# Altium schematic sheet MIXR Input System - Buffer.SchDoc
size B
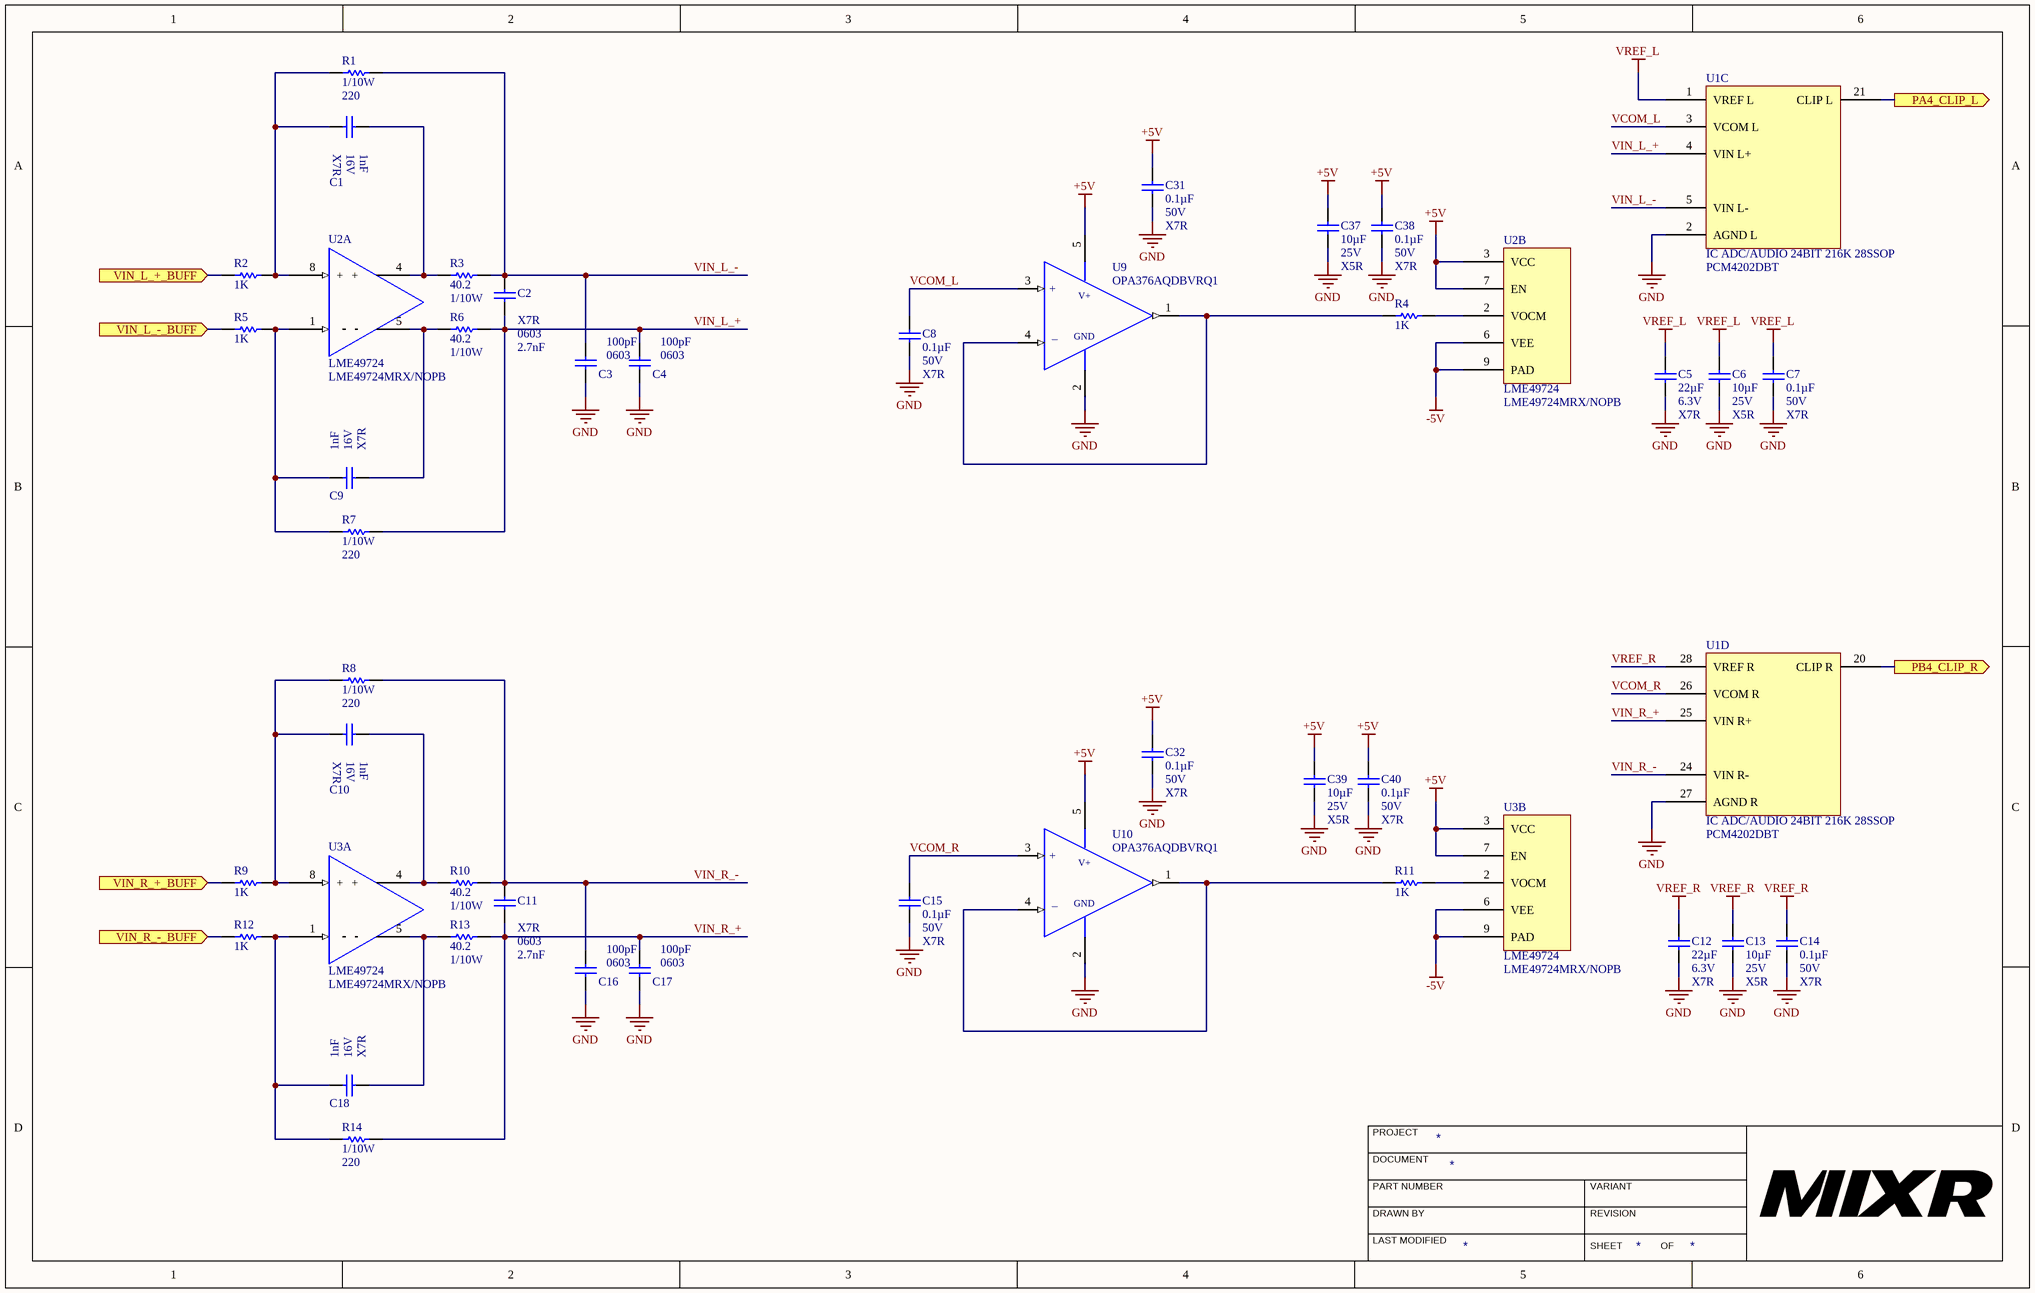
[diagram p0: MIXR Input System - Buffer.SchDoc]

## Parts
C1  CAP CER 1NF 16V 10% X7R 0603  [CAP, 0603]  (value not drawn)
C2  Dielectric: X7R  Case Code (Imperial): 0603  Capacitance: 2.7nF  [CAP, 0603]  (hidden comment: CAP CER 2700PF 50V X7R 0603)
C3  Case Code (Imperial): 0603  Capacitance: 100pF  [CAP, 0603]  (hidden comment: CAP CER 100PF 50V C0G/NP0 0603)
C4  Case Code (Imperial): 0603  Capacitance: 100pF  [CAP, 0603]  (hidden comment: CAP CER 100PF 50V C0G/NP0 0603)
C5  Capacitance: 22µF  Voltage: 6.3V  Temperature Coefficient: X7R  [CAP, 1206]  (hidden comment: CAP CER 22UF 6.3V ±10% X7R 1206)
C6  Capacitance: 10µF  Voltage: 25V  Temperature Coefficient: X5R  [CAP, 0603]  (hidden comment: CAP CER 10uF 25V 20% X5R 0603)
C7  Capacitance: 0.1µF  Voltage: 50V  Temperature Coefficient: X7R  [CAP, 0603]  (hidden comment: CAP CER 0.1UF 50V 10% X7R 0603)
C8  Capacitance: 0.1µF  Voltage: 50V  Temperature Coefficient: X7R  [CAP, 0603]  (hidden comment: CAP CER 0.1UF 50V 10% X7R 0603)
C9  CAP CER 1NF 16V 10% X7R 0603  [CAP, 0603]  (value not drawn)
C10  CAP CER 1NF 16V 10% X7R 0603  [CAP, 0603]  (value not drawn)
C11  Dielectric: X7R  Case Code (Imperial): 0603  Capacitance: 2.7nF  [CAP, 0603]  (hidden comment: CAP CER 2700PF 50V X7R 0603)
C12  Capacitance: 22µF  Voltage: 6.3V  Temperature Coefficient: X7R  [CAP, 1206]  (hidden comment: CAP CER 22UF 6.3V ±10% X7R 1206)
C13  Capacitance: 10µF  Voltage: 25V  Temperature Coefficient: X5R  [CAP, 0603]  (hidden comment: CAP CER 10uF 25V 20% X5R 0603)
C14  Capacitance: 0.1µF  Voltage: 50V  Temperature Coefficient: X7R  [CAP, 0603]  (hidden comment: CAP CER 0.1UF 50V 10% X7R 0603)
C15  Capacitance: 0.1µF  Voltage: 50V  Temperature Coefficient: X7R  [CAP, 0603]  (hidden comment: CAP CER 0.1UF 50V 10% X7R 0603)
C16  Case Code (Imperial): 0603  Capacitance: 100pF  [CAP, 0603]  (hidden comment: CAP CER 100PF 50V C0G/NP0 0603)
C17  Case Code (Imperial): 0603  Capacitance: 100pF  [CAP, 0603]  (hidden comment: CAP CER 100PF 50V C0G/NP0 0603)
C18  CAP CER 1NF 16V 10% X7R 0603  [CAP, 0603]  (value not drawn)
C31  Capacitance: 0.1µF  Voltage: 50V  Temperature Coefficient: X7R  [CAP, 0603]  (hidden comment: CAP CER 0.1UF 50V 10% X7R 0603)
C32  Capacitance: 0.1µF  Voltage: 50V  Temperature Coefficient: X7R  [CAP, 0603]  (hidden comment: CAP CER 0.1UF 50V 10% X7R 0603)
C37  Capacitance: 10µF  Voltage: 25V  Temperature Coefficient: X5R  [CAP, 0603]  (hidden comment: CAP CER 10uF 25V 20% X5R 0603)
C38  Capacitance: 0.1µF  Voltage: 50V  Temperature Coefficient: X7R  [CAP, 0603]  (hidden comment: CAP CER 0.1UF 50V 10% X7R 0603)
C39  Capacitance: 10µF  Voltage: 25V  Temperature Coefficient: X5R  [CAP, 0603]  (hidden comment: CAP CER 10uF 25V 20% X5R 0603)
C40  Capacitance: 0.1µF  Voltage: 50V  Temperature Coefficient: X7R  [CAP, 0603]  (hidden comment: CAP CER 0.1UF 50V 10% X7R 0603)
R1  Power (Watts): 1/10W  Resistance: 220  [RES, 0603]  (hidden comment: RES 220 OHM 1% 1/10W 0603)
R2  1K  [RES, 0603]
R3  Resistance: 40.2  Power: 1/10W  [RES, 0603]  (hidden comment: RES 40.2 OHM 0.5% 1/10W 0603)
R4  1K  [RES, 0603]
R5  1K  [RES, 0603]
R6  Resistance: 40.2  Power: 1/10W  [RES, 0603]  (hidden comment: RES 40.2 OHM 0.5% 1/10W 0603)
R7  Power (Watts): 1/10W  Resistance: 220  [RES, 0603]  (hidden comment: RES 220 OHM 1% 1/10W 0603)
R8  Power (Watts): 1/10W  Resistance: 220  [RES, 0603]  (hidden comment: RES 220 OHM 1% 1/10W 0603)
R9  1K  [RES, 0603]
R10  Resistance: 40.2  Power: 1/10W  [RES, 0603]  (hidden comment: RES 40.2 OHM 0.5% 1/10W 0603)
R11  1K  [RES, 0603]
R12  1K  [RES, 0603]
R13  Resistance: 40.2  Power: 1/10W  [RES, 0603]  (hidden comment: RES 40.2 OHM 0.5% 1/10W 0603)
R14  Power (Watts): 1/10W  Resistance: 220  [RES, 0603]  (hidden comment: RES 220 OHM 1% 1/10W 0603)
U1  IC ADC/AUDIO 24BIT 216K 28SSOP  Manufacturer Part Number: PCM4202DBT  [IC ADC 24 BIT AUDIO 216 KHZ SSOP-28]  (parts C,D of 4)
U2  LME49724  Manufacturer Part Number: LME49724MRX/NOPB  [IC OP AMP AUDIO LME49724 8-SOIC]  (parts A,B of 2)
U3  LME49724  Manufacturer Part Number: LME49724MRX/NOPB  [IC OP AMP AUDIO LME49724 8-SOIC]  (parts A,B of 2)
U9  Manufacturer Part Number: OPA376AQDBVRQ1  [IC OP AMP GP RR 10MHZ SOT-23-5]  (hidden comment: IC OP AMP GEN PURPOSE RR 5.5MHZ SOT-23-5)
U10  Manufacturer Part Number: OPA376AQDBVRQ1  [IC OP AMP GP RR 10MHZ SOT-23-5]  (hidden comment: IC OP AMP GEN PURPOSE RR 5.5MHZ SOT-23-5)

## Ports
PA4_CLIP_L (out), PB4_CLIP_R (out), VIN_L_+_BUFF (in), VIN_L_-_BUFF (in), VIN_R_+_BUFF (in), VIN_R_-_BUFF (in)

## Nets
+5V: C31.1 C32.1 C37.1 C38.1 C39.1 C40.1 U2.3(VCC) U2.7(EN) U3.3(VCC) U3.7(EN) U9.5(VDD) U10.5(VDD)
-5V: U2.6(VEE) U2.9(PAD) U3.6(VEE) U3.9(PAD)
GND: C3.2 C4.2 C5.2 C6.2 C7.2 C8.2 C12.2 C13.2 C14.2 C15.2 C16.2 C17.2 C31.2 C32.2 C37.2 C38.2 C39.2 C40.2 U1.2(AGND_L) U1.27(AGND_R) U9.2(VSS) U10.2(VSS)
VREF_L: C5.1 C6.1 C7.1 U1.1(VREF_L)
VREF_R: C12.1 C13.1 C14.1 U1.28(VREF_R)
PA4_CLIP_L: U1.21(CLIP_L) ; port PA4_CLIP_L
PB4_CLIP_R: U1.20(CLIP_R) ; port PB4_CLIP_R
VCOM_L: C8.1 U1.3(VCOM_L) U9.3(+IN)
VCOM_R: C15.1 U1.26(VCOM_R) U10.3(+IN)
VIN_L_+: C2.2 C4.1 R6.2 R7.1 U1.4(VIN_L+)
VIN_L_+_BUFF: R2.1 ; port VIN_L_+_BUFF
VIN_L_-: C2.1 C3.1 R1.2 R3.2 U1.5(VIN_L-)
VIN_L_-_BUFF: R5.1 ; port VIN_L_-_BUFF
VIN_R_+: C11.2 C17.1 R13.2 R14.1 U1.25(VIN_R+)
VIN_R_+_BUFF: R9.1 ; port VIN_R_+_BUFF
VIN_R_-: C11.1 C16.1 R8.2 R10.2 U1.24(VIN_R-)
VIN_R_-_BUFF: R12.1 ; port VIN_R_-_BUFF
NetC1_1: C1.1 R3.1 U2.4(+)
NetC1_2: C1.2 R1.1 R2.2 U2.8(+)
NetC9_1: C9.1 R5.2 R7.2 U2.1(-)
NetC9_2: C9.2 R6.1 U2.5(-)
NetC10_1: C10.1 R10.1 U3.4(+)
NetC10_2: C10.2 R8.1 R9.2 U3.8(+)
NetC18_1: C18.1 R12.2 R14.2 U3.1(-)
NetC18_2: C18.2 R13.1 U3.5(-)
NetR4_1: R4.1 U9.1(OUTPUT) U9.4(-IN)
NetR4_2: R4.2 U2.2(VOCM)
NetR11_1: R11.1 U10.1(OUTPUT) U10.4(-IN)
NetR11_2: R11.2 U3.2(VOCM)

## Notes on the sheet
- PROJECT
- DOCUMENT
- DRAWN BY
- LAST MODIFIED
- PART NUMBER
- REVISION
- SHEET
- VARIANT
- OF
- (in symbol CAP CER 1NF 16V 10% X7R 0603) X7R; 16V; 1nF
- (in symbol IC OP AMP GEN PURPOSE RR 5.5MHZ SOT-23-5) +; V+; GND; _

## Library data of the parts
C1 C9 C10 C18 = CAP CER 1NF 16V 10% X7R 0603: 1000pF ±10% 16V Ceramic Capacitor X7R 0603 (1608 Metric); Manufacturer: KEMET; Manufacturer Part Number: C0603C102K4RECAUTO; Supplier 1: Digi-Key; RoHS: No; Stock 1: 7692; Pricing 1: 1 = 0.19000, 10 = 0.13200, 100 = 0.06210, 500 = 0.04356, 1000 = 0.03606 (USD); ComponentLink1URL: https://api.kemet.com/component-edge/download/datasheet/C0603C102K4RECAUTO.pdf?src-supplier=Digi-Key; ComponentLink1Description: https://api.kemet.com/component-edge/download/datasheet/C0603C102K4RECAUTO.pdf?src-supplier=Digi-Key; Supplier Part Number 1: 399-17878-1-ND
C2 C11 = CAP CER 2700PF 50V X7R 0603: 2700pF ±10% 50V Ceramic Capacitor X7R 0603 (1608 Metric); Manufacturer: KEMET; Manufacturer Part Number: C0603C272K5RACTU; Supplier 1: Digi-Key; RoHS: Yes; Stock 1: 166011; Pricing 1: 1 = 0.11000, 10 = 0.08200, 100 = 0.03660, 500 = 0.02614, 1000 = 0.02054 (USD); Mount: Surface Mount; Case/Package: 0603; Number of Pins: 2; Case Code (Metric): 1608; Dielectric Material: Ceramic; Min Operating Temperature: -55°C; Max Operating Temperature: 125°C; Voltage Rating: 50V; Tolerance: 10%; Packaging: Tape and Reel; Voltage Rating (DC): 50V; Package Quantity: 1; Termination: SMD/SMT; Voltage: 50V; Length: 1.6mm; Height: 0.8mm; Width: 0.031inch; Thickness: 0.034inch; Lead Pitch: 0.7mm; Depth: 0.8mm; Radiation Hardening: No; REACH SVHC: No SVHC; ComponentLink1URL: https://datasheet.ciiva.com/18192/getdatasheetpartid-321287-18192955.pdf?src-supplier=Verical; ComponentLink1Description: https://datasheet.ciiva.com/18192/getdatasheetpartid-321287-18192955.pdf?src-supplier=Verical; ComponentLink2URL: https://datasheet.ciiva.com/7823/1633156-7823726.pdf?src-supplier=Element14; ComponentLink2Description: https://datasheet.ciiva.com/7823/1633156-7823726.pdf?src-supplier=Element14; ComponentLink3URL: https://datasheet.ciiva.com/7823/1633156-7823727.pdf?src-supplier=Element14; ComponentLink3Description: https://datasheet.ciiva.com/7823/1633156-7823727.pdf?src-supplier=Element14; Supplier Part Number 1: 399-7890-1-ND
C3 C4 C16 C17 = CAP CER 100PF 50V C0G/NP0 0603: 100pF ±1% 50V Ceramic Capacitor C0G, NP0 0603 (1608 Metric); Manufacturer: Kyocera AVX; Manufacturer Part Number: 06035A101FAT2A; Supplier 1: Digi-Key; Stock 1: 176069; Pricing 1: 1=0.24, 10=0.161, 100=0.0814, 500=0.0557, 1000=0.0493 (USD); Mount: Surface Mount; Case/Package: 0603; Case Code (Metric): 1608; Min Operating Temperature: -55°C; Max Operating Temperature: 125°C; Tolerance: 1%; Packaging: Tape and Reel; Voltage Rating: 50V; Package Quantity: 1; Voltage Rating (DC): 50V; Dielectric: C0G; Termination: SMD/SMT; Voltage: 50V; Length: 1.6mm; Height: 0.86mm; Width: 0.81mm; Thickness: 0.035inch; Depth: 0.81mm; Radiation Hardening: No; REACH SVHC: No SVHC; Lead Free: Lead Free; ComponentLink1URL: https://datasheet.ciiva.com/22682/1796416-22682854.pdf; ComponentLink1Description: https://datasheet.ciiva.com/22682/1796416-22682854.pdf; ComponentLink2URL: https://datasheet.ciiva.com/150/ccog-150746.pdf; ComponentLink2Description: https://datasheet.ciiva.com/150/ccog-150746.pdf; ComponentLink3URL: https://datasheet.ciiva.com/150/ccog-150747.pdf; ComponentLink3Description: https://datasheet.ciiva.com/150/ccog-150747.pdf; ComponentLink4URL: https://datasheet.ciiva.com/150/ccog-150748.pdf; ComponentLink4Description: https://datasheet.ciiva.com/150/ccog-150748.pdf; ComponentLink5URL: https://datasheet.ciiva.com/28585/1796416-28585980.pdf; ComponentLink5Description: https://datasheet.ciiva.com/28585/1796416-28585980.pdf; ComponentLink6URL: https://datasheet.ciiva.com/16300/ccog-16300413.pdf; ComponentLink6Description: https://datasheet.ciiva.com/16300/ccog-16300413.pdf; ComponentLink7URL: https://datasheet.ciiva.com/17492/ccog-17492189.pdf; ComponentLink7Description: https://datasheet.ciiva.com/17492/ccog-17492189.pdf; Supplier Part Number 1: 478-6202-1-ND
C5 C12 = CAP CER 22UF 6.3V ±10% X7R 1206: 22µF ±10% 6.3V Ceramic Capacitor X7R 1206 (3216 Metric); Manufacturer 1: Murata Electronics North America; Manufacturer Part Number 1: GRM31CR70J226KE19L; Supplier 1: Digi-Key; Supplier Part Number 1: 490-6515-1-ND; Packaging: Cut Tape (CT); Part Status: Active; Operating Temperature: -55°C ~ 125°C; Ratings: -; Mounting Type: Surface Mount, MLCC; Package / Case: 1206 (3216 Metric); Size / Dimension: 0.126" L x 0.063" W (3.20mm x 1.60mm); Height - Seated (Max): -; Thickness (Max): 0.071" (1.80mm); Lead Spacing: -; Lead Style: -; ComponentLink1URL: http://www.murata.com/~/media/webrenewal/support/library/catalog/products/capacitor/mlcc/c02e.ashx; ComponentLink1Description: http://www.murata.com/~/media/webrenewal/support/library/catalog/products/capacitor/mlcc/c02e.ashx; Tolerance: ±10%
C6 C13 C37 C39 = CAP CER 10uF 25V 20% X5R 0603: 10µF ±20% 25V Ceramic Capacitor X5R 0603 (1608 Metric); Manufacturer 1: Murata Electronics North America; Manufacturer Part Number 1: GRM188R61E106MA73D; Supplier 1: Digi-Key; Supplier Part Number 1: 490-7202-1-ND; Packaging: Cut Tape (CT); Part Status: Active; Operating Temperature: -55°C ~ 85°C; Ratings: -; Mounting Type: Surface Mount, MLCC; Package / Case: 0603 (1608 Metric); Size / Dimension: 0.063" L x 0.031" W (1.60mm x 0.80mm); Height - Seated (Max): -; Thickness (Max): 0.031" (0.80mm); Lead Spacing: -; Lead Style: -; ComponentLink1URL: http://www.murata.com/~/media/webrenewal/support/library/catalog/products/capacitor/mlcc/c02e.ashx; ComponentLink1Description: http://www.murata.com/~/media/webrenewal/support/library/catalog/products/capacitor/mlcc/c02e.ashx; Tolerance: ±20%
C7 C8 C14 C15 C31 C32 C38 C40 = CAP CER 0.1UF 50V 10% X7R 0603: 0.10µF ±10% 50V Ceramic Capacitor X7R 0603 (1608 Metric); Manufacturer 1: AVX Corporation; Manufacturer Part Number 1: 06035C104KAT2A; Supplier 1: Digi-Key; Supplier Part Number 1: 478-5052-1-ND; Packaging: Cut Tape (CT); Part Status: Active; Operating Temperature: -55°C ~ 125°C; Ratings: -; Mounting Type: Surface Mount, MLCC; Package / Case: 0603 (1608 Metric); Size / Dimension: 0.063" L x 0.032" W (1.60mm x 0.81mm); Height - Seated (Max): -; Thickness (Max): 0.035" (0.90mm); Lead Spacing: -; Lead Style: -; ComponentLink1URL: http://datasheets.avx.com/X7RDielectric.pdf; ComponentLink1Description: http://datasheets.avx.com/X7RDielectric.pdf; Tolerance: ±10%
R1 R7 R8 R14 = RES 220 OHM 1% 1/10W 0603: 220 Ohms ±1% 0.1W, 1/10W Chip Resistor 0603 (1608 Metric) Moisture Resistant Thick Film; Manufacturer: Yageo; Manufacturer Part Number: RC0603FR-07220RL; Temperature Coefficient: ±100ppm/°C; Supplier 1: Digi-Key; RoHS: RoHS Compliant; Category: Resistors; Stock 1: 1318812; Pricing 1: 1=0.15, 10=0.022, 100=0.0088, 1000=0.00392, 2500=0.0034 (CAD); Packaging: Cut Tape (CT); Part Status: Active; Tolerance: ±1%; Composition: Thick Film; Features: Moisture Resistant; Operating Temperature: -55°C ~ 155°C; Package / Case: 0603 (1608 Metric); Supplier Device Package: 0603; Size / Dimension: 0.063" L x 0.032" W (1.60mm x 0.80mm); Height - Seated (Max): 0.022" (0.55mm); Failure Rate: -; ComponentLink1URL: http://www.yageo.com/documents/recent/PYu-RC_Group_51_RoHS_L_8.pdf; ComponentLink1Description: http://www.yageo.com/documents/recent/PYu-RC_Group_51_RoHS_L_8.pdf; Supplier Part Number 1: 311-220HRCT-ND
R2 R4 R5 R9 R11 R12 = RES 1K OHM 5% 1/10W 0603: 1k Ohm ±5% 0.1W, 1/10W Chip Resistor 0603 (1608 Metric); Manufacturer: Yageo; Manufacturer Part Number: RC0603JR-071KL; Temperature Coefficient: ±100ppm/°C; Supplier 1: Digi-Key; Supplier Part Number 1: 311-1.0KGRCT-ND; RoHS: RoHS Compliant; Category: Resistors; Stock 1: 4415240; Pricing 1: 1=0.15, 10=0.017, 100=0.0071, 1000=0.0032, 2500=0.00278 (CAD); Packaging: Cut Tape (CT); Part Status: Active; Resistance (Ohms): 1k; Tolerance: ±5%; Power (Watts): 0.1W, 1/10W; Composition: Thick Film; Features: Moisture Resistant; Operating Temperature: -55°C ~ 155°C; Package / Case: 0603 (1608 Metric); Supplier Device Package: 0603; Size / Dimension: 0.063" L x 0.031" W (1.60mm x 0.80mm); Height - Seated (Max): 0.022" (0.55mm); Failure Rate: -; ComponentLink1URL: http://www.yageo.com/documents/recent/PYu-RC_Group_51_RoHS_L_7.pdf; ComponentLink1Description: http://www.yageo.com/documents/recent/PYu-RC_Group_51_RoHS_L_7.pdf
R3 R6 R10 R13 = RES 40.2 OHM 0.5% 1/10W 0603: RES SMD 40.2 OHM 0.5% 1/10W 0603; Manufacturer 1: Yageo; Manufacturer Part Number 1: RT0603DRE0740R2L; Temperature Coefficient: ±50ppm/°C; Supplier 1: Digi-Key; Supplier Part Number 1: 311-2576-1-ND; Packaging: Cut Tape (CT); Part Status: Active; Composition: Thin Film; Operating Temperature: -55°C ~ 155°C; Package / Case: 0603 (1608 Metric); Supplier Device Package: 0603; Size / Dimension: 0.063" L x 0.031" W (1.60mm x 0.80mm); Height - Seated (Max): 0.022" (0.55mm); Failure Rate: -; ComponentLink1URL: http://www.yageo.com/documents/recent/PYu-RT_1-to-0.01_RoHS_L_7.pdf; ComponentLink1Description: http://www.yageo.com/documents/recent/PYu-RT_1-to-0.01_RoHS_L_7.pdf; Tolerance: ±0.5%
U1 = IC ADC 24 BIT AUDIO 216KHZ SSOP-28: ADC, Audio 24 bit 216k DSP, PCM 28-SSOP; Manufacturer: Texas Instruments; Operating Supply Voltage: 5V; Interface: Serial; Number of Bits: 24; Sampling Rate: 216KS/s; Number of A/D Converters: 2; Max Power Dissipation: 408mW; Max Supply Voltage: 5.25V; Min Supply Voltage: 4.75V; Nominal Supply Current: 55mA; Power Consumption: 338mW; Resolution: 24b; Polarity: Bipolar; Number of Analog Inputs: 1; Supply Type: Analog; Number of DAC Channels: 0; Supplier 1: Digi-Key; Supplier Part Number 1: 296-17438-1-ND; Stock 1: 5943; Pricing 1: 1 = 9.85000, 10 = 8.89800, 100 = 7.36660 (USD); RoHS: Yes; Mount: Surface Mount; Case/Package: SSOP; Number of Pins: 28; Weight: 0.008529oz; Min Operating Temperature: -10°C; Max Operating Temperature: 70°C; Package Quantity: 250; Packaging: Tape and Reel; Number of Converters: 2; Number of Elements: 2; Power Dissipation: 408mW; Conversion Rate: 216KS/s; Number of ADC Channels: 2; Length: 10.2mm; Height: 1.95mm; Width: 5.3mm; Radiation Hardening: No; Lead Free: Lead Free; REACH SVHC: No SVHC; ComponentLink1URL: https://datasheet.ciiva.com/25988/sbas290b-25988737.pdf?src-supplier=Avnet+Europe; ComponentLink1Description: https://datasheet.ciiva.com/25988/sbas290b-25988737.pdf?src-supplier=Avnet+Europe; ComponentLink2URL: https://datasheet.ciiva.com/41460/001186374-da-01-en-ic-adc-stereo-24b-pcm4202dbt-ssop-28-tid-41460403.pdf?src-supplier=Conrad; ComponentLink2Description: https://datasheet.ciiva.com/41460/001186374-da-01-en-ic-adc-stereo-24b-pcm4202dbt-ssop-28-tid-41460403.pdf?src-supplier=Conrad; ComponentLink3URL: https://datasheet.ciiva.com/26800/pcm4202dbt-26800794.pdf?src-supplier=IIIC; ComponentLink3Description: https://datasheet.ciiva.com/26800/pcm4202dbt-26800794.pdf?src-supplier=IIIC; ComponentLink4URL: https://datasheet.ciiva.com/29896/sbas290b-29896124.pdf?src-supplier=Avnet; ComponentLink4Description: https://datasheet.ciiva.com/29896/sbas290b-29896124.pdf?src-supplier=Avnet; ComponentLink5URL: https://datasheet.ciiva.com/1307/pcm4202-1307121.pdf?src-supplier=Digi-Key; ComponentLink5Description: https://datasheet.ciiva.com/1307/pcm4202-1307121.pdf?src-supplier=Digi-Key; ComponentLink6URL: https://datasheet.ciiva.com/1307/pcm4202-1307122.pdf?src-supplier=Digi-Key; ComponentLink6Description: https://datasheet.ciiva.com/1307/pcm4202-1307122.pdf?src-supplier=Digi-Key; ComponentLink7URL: https://datasheet.ciiva.com/1307/pcm4202-1307123.pdf?src-supplier=Digi-Key; ComponentLink7Description: https://datasheet.ciiva.com/1307/pcm4202-1307123.pdf?src-supplier=Digi-Key; ComponentLink8URL: https://datasheet.ciiva.com/15147/getdatasheetpartid-171631-15147899.pdf?src-supplier=Verical; ComponentLink8Description: https://datasheet.ciiva.com/15147/getdatasheetpartid-171631-15147899.pdf?src-supplier=Verical
U2 U3 = IC OP AMP AUDIO LME49724 8-SOIC: Audio Amplifier 1 Circuit Differential 8-SO PowerPad; Manufacturer: TI National Semiconductor; Max Supply Voltage: 36V; Min Supply Voltage: 5V; Voltage Gain: 125dB; Unity Gain Bandwidth Product: 50MHz; Slew Rate: 18V/µs; Common Mode Rejection Ratio: 95dB; Min Dual Supply Voltage: 2.5V; Max Dual Supply Voltage: 18V; Output Current: 80mA; Number of Circuits: 1; Input Bias Current: 60nA; Input Offset Voltage (Vos): 200uV; Operating Supply Current: 10mA; Supplier 1: Digi-Key; Supplier Part Number 1: 296-37390-1-ND; Stock 1: 17947; Pricing 1: 1 = 2.67000, 10 = 2.40200, 100 = 1.93060, 500 = 1.58620, 1000 = 1.31428 (USD); RoHS: Yes; Mount: Surface Mount; Number of Pins: 8; Contact Plating: Tin; Min Operating Temperature: -40°C; Max Operating Temperature: 85°C; Packaging: Tape and Reel; Package Quantity: 2500; Gain Bandwidth Product: 50MHz; Output Current per Channel: 80mA; Number of Channels: 1; Number of Elements: 1; Power Supply Rejection Ratio (PSRR): 95dB; Radiation Hardening: No; Lead Free: Lead Free; ComponentLink1URL: https://datasheet.ciiva.com/29638/lme49724-29638149.pdf?src-supplier=Digi-Key; ComponentLink1Description: https://datasheet.ciiva.com/29638/lme49724-29638149.pdf?src-supplier=Digi-Key; ComponentLink2URL: https://datasheet.ciiva.com/29638/lme49724-29638731.pdf?src-supplier=Digi-Key; ComponentLink2Description: https://datasheet.ciiva.com/29638/lme49724-29638731.pdf?src-supplier=Digi-Key; ComponentLink3URL: https://datasheet.ciiva.com/1818/lme49724-1818445.pdf?src-supplier=Digi-Key; ComponentLink3Description: https://datasheet.ciiva.com/1818/lme49724-1818445.pdf?src-supplier=Digi-Key
U9 U10 = IC OP AMP GEN PURPOSE RR 5.5MHZ SOT-23-5: General Purpose Amplifier 1 Circuit Rail-to-Rail SOT-23-5; Manufacturer: Texas Instruments; Max Supply Voltage: 5.5V; Min Supply Voltage: 2.2V; Output Current: 30mA; Nominal Supply Current: 950uA; Voltage Gain: 134dB; Common Mode Rejection Ratio: 76dB; Number of Channels: 1; Slew Rate: 2V/µs; Max I/O Voltage: 25uV; Input Bias Current: 10pA; Operating Supply Current: 760uA; Output Current per Channel: 50mA; Power Supply Rejection Ratio (PSRR): 106.02dB; Supplier 1: Digi-Key; Stock 1: 26635; Pricing 1: 1 = 2.14000, 10 = 1.92200, 100 = 1.54450, 500 = 1.26896, 1000 = 1.05142 (USD); RoHS: Yes; Case/Package: SOT-23-5; Number of Pins: 5; Min Operating Temperature: -40°C; Max Operating Temperature: 125°C; Unity Gain Bandwidth Product: 5.5MHz; Packaging: Tape and Reel; Package Quantity: 3000; Number of Circuits: 1; Gain Bandwidth Product: 5.5MHz; Input Offset Voltage (Vos): 25uV; Number of Elements: 1; Radiation Hardening: No; Lead Free: Lead Free; ComponentLink1URL: http://www.ti.com/lit/ds/sbos549/sbos549.pdf?src-supplier=Avnet; ComponentLink1Description: http://www.ti.com/lit/ds/sbos549/sbos549.pdf?src-supplier=Avnet; Supplier Part Number 1: 296-36701-1-ND